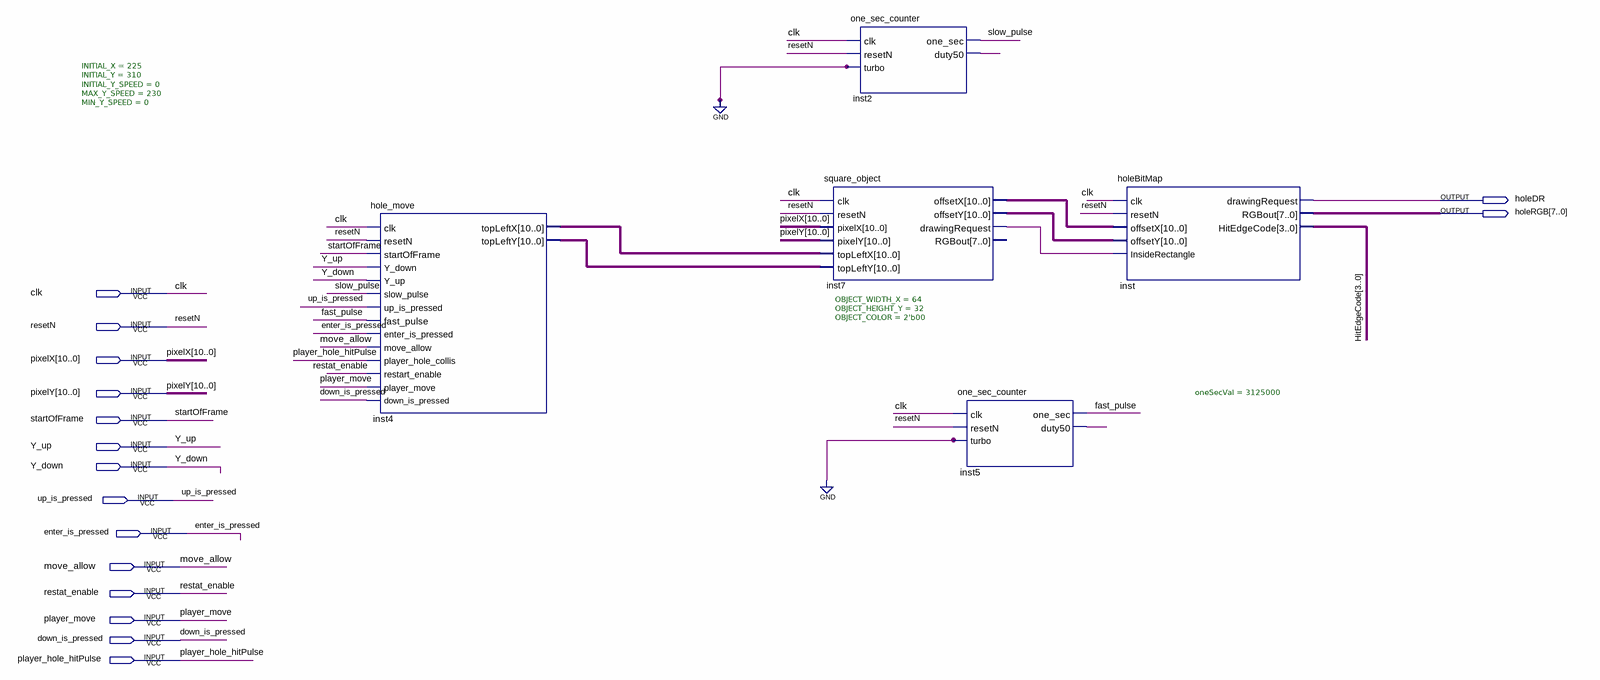
[diagram p0: schematic sheet]
// Quartus schematic hole_block.bdf as structural Verilog: 5 symbols, 16 pins
module hole_block (
  input  clk,
  input  resetN,
  input  [10:0] pixelX,
  input  [10:0] pixelY,
  input  startOfFrame,
  input  Y_up,
  input  Y_down,
  input  up_is_pressed,
  input  enter_is_pressed,
  input  move_allow,
  input  restat_enable,
  input  player_move,
  input  down_is_pressed,
  input  player_hole_hitPulse,
  output holeDR,
  output [7:0] holeRGB
);

  wire fast_pulse, inst2_duty50, inst5_duty50, inst7_drawingrequest, slow_pulse;
  wire [3:0] HitEdgeCode;
  wire [10:0] inst4_topleftx, inst4_toplefty, inst7_offsetx, inst7_offsety;

  hole_move #(.INITIAL_X(225), .INITIAL_Y(310), .INITIAL_Y_SPEED(0), .MAX_Y_SPEED(230), .MIN_Y_SPEED(0)) inst4 (
    .clk(clk), .resetN(resetN), .startOfFrame(startOfFrame), .Y_down(Y_up), .Y_up(Y_down),
    .slow_pulse(slow_pulse), .up_is_pressed(up_is_pressed), .fast_pulse(fast_pulse),
    .enter_is_pressed(enter_is_pressed), .move_allow(move_allow), .player_hole_collis(player_hole_hitPulse),
    .restart_enable(restat_enable), .player_move(player_move), .down_is_pressed(down_is_pressed),
    .topLeftX(inst4_topleftx), .topLeftY(inst4_toplefty));
  one_sec_counter inst2 (.clk(clk), .resetN(resetN), .turbo(1'b0), .one_sec(slow_pulse), .duty50(inst2_duty50));
  square_object #(.OBJECT_WIDTH_X(64), .OBJECT_HEIGHT_Y(32), .OBJECT_COLOR(2'b00)) inst7 (
    .clk(clk), .resetN(resetN), .pixelX(pixelX), .pixelY(pixelY), .topLeftX(inst4_topleftx),
    .topLeftY(inst4_toplefty), .offsetX(inst7_offsetx), .offsetY(inst7_offsety),
    .drawingRequest(inst7_drawingrequest));  // open: RGBout
  one_sec_counter #(.oneSecVal(3125000)) inst5 (
    .clk(clk), .resetN(resetN), .turbo(1'b0), .one_sec(fast_pulse), .duty50(inst5_duty50));
  holeBitMap inst (
    .clk(clk), .resetN(resetN), .offsetX(inst7_offsetx), .offsetY(inst7_offsety),
    .InsideRectangle(inst7_drawingrequest), .drawingRequest(holeDR), .RGBout(holeRGB),
    .HitEdgeCode(HitEdgeCode));
endmodule
